# Altium schematic sheet Sheet2.SchDoc
size A4
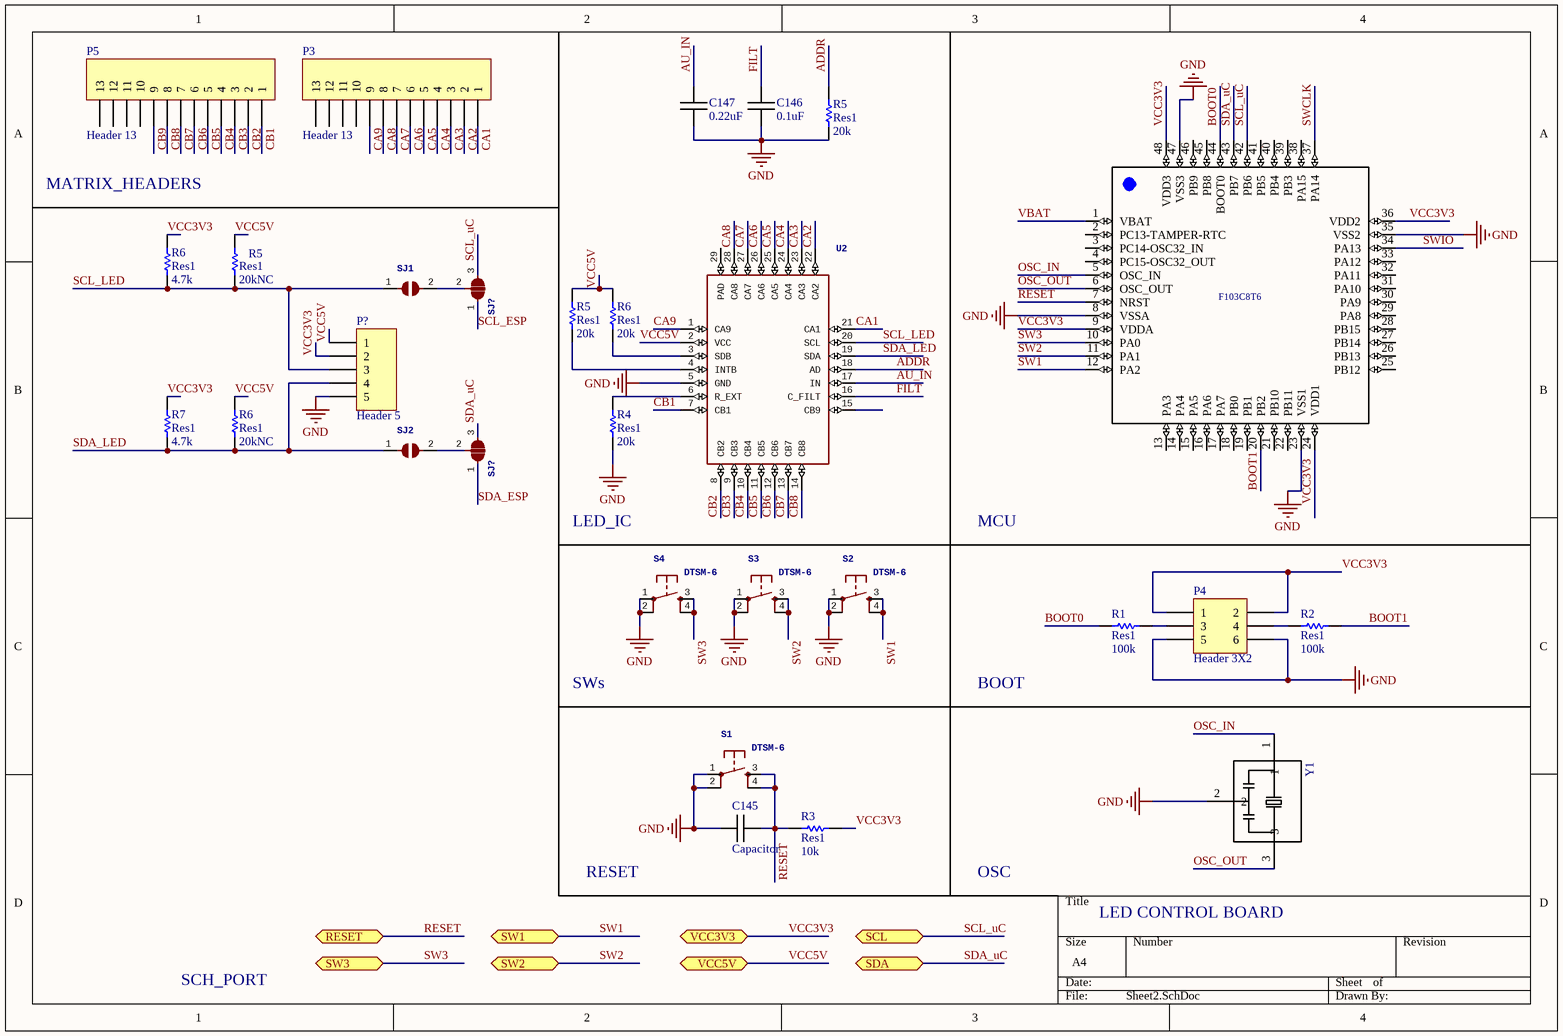
[diagram p0: Sheet2.SchDoc]

## Parts
(Parts that share a designator on the sheet are numbered #1, #2 ... from top to bottom, then left to right.)
C145  Capacitor  [C 0603 / 1608]
C146  0.1uF  [C 0603 / 1608]
C147  0.22uF  [C 0603 / 1608]
P3  Header 13  [HDR1X13]
P4  Header 3X2  [HDR2X3]
P5  Header 13  [HDR1X13]
P?  Header 5  [HDR1X5]
R1  Res1  value 100k  [C 0603 / 1608]
R2  Res1  value 100k  [C 0603 / 1608]
R3  Res1  value 10k  [C 0603 / 1608]
R4  Res1  value 20k  [C 0603 / 1608]
R5#1  Res1  value 20k  [C 0603 / 1608]
R5#2  Res1  value 20kNC  [C 0603 / 1608]
R5#3  Res1  value 20k  [C 0603 / 1608]
R6#1  Res1  value 4.7k  [C 0603 / 1608]
R6#2  Res1  value 20k  [C 0603 / 1608]
R6#3  Res1  value 20kNC  [C 0603 / 1608]
R7  Res1  value 4.7k  [C 0603 / 1608]
S1  DTSM-6  [DTSM-6]
S2  DTSM-6  [DTSM-6]
S3  DTSM-6  [DTSM-6]
S4  DTSM-6  [DTSM-6]
SJ1  (no value)  [SOLDERJUMPER_CLOSEDWIRE]
SJ2  (no value)  [SOLDERJUMPER_CLOSEDWIRE]
SJ?#1  (no value)  [SOLDERJUMPER_2WAY_OPEN_NOPASTE]
SJ?#2  (no value)  [SOLDERJUMPER_2WAY_OPEN_NOPASTE]
U1  STM32F103C8T6  [LQFP48_7X7MM_0.5MMPP]  (value not drawn)
U2  LED Lighting Drivers LED Driver   Source:  Datasheet  [QFN40P400X400X80-29N]  (value not drawn)
Y1  (no value)  [OSC_CSTCE8M00G55-R0]

## Ports
RESET (bidir), SCL (bidir), SDA (bidir), SW1 (bidir), SW2 (bidir), SW3 (bidir), VCC3V3 (bidir), VCC5V (bidir)

## Nets
GND: C145.2 C146.1 C147.1 P4.5 P4.6 P?.5 R4.2 R5#1.1 S1.1 S1.2 S2.1 S2.2 S3.1 S3.2 S4.1 S4.2 U1.8(VSSA) U1.23(VSS1) U1.35(VSS2) U1.47(VSS3) U2.5(GND) Y1.2
ADDR: R5#1.2 U2.18(AD)
AU_IN: C147.2 U2.17(IN)
BOOT0: R1.1 U1.44(BOOT0)
BOOT1: R2.2 U1.20(PB2)
CA1: P3.1 U2.21(CA1)
CA2: P3.2 U2.22(CA2)
CA3: P3.3 U2.23(CA3)
CA4: P3.4 U2.24(CA4)
CA5: P3.5 U2.25(CA5)
CA6: P3.6 U2.26(CA6)
CA7: P3.7 U2.27(CA7)
CA8: P3.8 U2.28(CA8)
CA9: P3.9 U2.1(CA9)
CB1: P5.1 U2.7(CB1)
CB2: P5.2 U2.8(CB2)
CB3: P5.3 U2.9(CB3)
CB4: P5.4 U2.10(CB4)
CB5: P5.5 U2.11(CB5)
CB6: P5.6 U2.12(CB6)
CB7: P5.7 U2.13(CB7)
CB8: P5.8 U2.14(CB8)
CB9: P5.9
FILT: C146.2 U2.16(C_FILT)
OSC_IN: U1.5(OSC_IN) Y1.1
OSC_OUT: U1.6(OSC_OUT) Y1.3
RESET: C145.1 R3.2 S1.3 S1.4 U1.7(NRST) ; port RESET
SCL_ESP: SJ?#1.1
SCL_LED: P?.3 R5#2.2 R6#1.2 SJ1.1 U2.20(SCL)
SCL_uC: SJ?#1.3 U1.42(PB6) ; port SCL
SDA_ESP: SJ?#2.1
SDA_LED: P?.4 R6#3.2 R7.2 SJ2.1 U2.19(SDA)
SDA_uC: SJ?#2.3 U1.43(PB7) ; port SDA
SW1: S2.3 S2.4 U1.12(PA2) ; port SW1
SW2: S3.3 S3.4 U1.11(PA1) ; port SW2
SW3: S4.3 S4.4 U1.10(PA0) ; port SW3
SWCLK: U1.37(PA14)
SWIO: U1.34(PA13)
VBAT: U1.1(VBAT)
VCC3V3: P4.1 P4.2 P?.2 R3.1 R6#1.1 R7.1 U1.9(VDDA) U1.24(VDD1) U1.36(VDD2) U1.48(VDD3) ; port VCC3V3
VCC5V: P?.1 R5#2.1 R5#3.1 R6#2.1 R6#3.1 U2.2(VCC) ; port VCC5V
NetP4_3: P4.3 R1.2
NetP4_4: P4.4 R2.1
NetR4_1: R4.1 U2.6(R_EXT)
NetR5#3_2: R5#3.2 U2.4(INTB)
NetR6#2_2: R6#2.2 U2.3(SDB)
NetSJ1_2: SJ1.2 SJ?#1.2
NetSJ2_2: SJ2.2 SJ?#2.2

Not connected (* = marked no-connect by the designer): P3 10 11 12 13; P5 10 11 12 13; U1 2(PC13-TAMPER-RTC) 3(PC14-OSC32_IN) 4(PC15-OSC32_OUT) 13(PA3) 14(PA4) 15(PA5) 16(PA6) 17(PA7) 18(PB0) 19(PB1) 21(PB10) 22(PB11) 25(PB12) 26(PB13) 27(PB14) 28(PB15) 29(PA8) 30(PA9) 31(PA10) 32(PA11) 33(PA12) 38(PA15) 39(PB3) 40(PB4) 41(PB5) 45(PB8) 46(PB9); U2 15(CB9) 29(PAD)

## Notes on the sheet
- MATRIX_HEADERS
- LED_IC
- MCU
- SWs
- BOOT
- RESET
- OSC
- LED CONTROL BOARD
- SCH_PORT
- (in symbol STM32F103C8T6) F103C8T6

## Library data of the parts
C146 C147 = Capacitor
P3 P5 = Header 13: Header, 13-Pin; LatestRevisionDate: 17-Jul-2002; LatestRevisionNote: Re-released for DXP Platform.; Publisher: Altium Limited
P4 = Header 3X2: Header, 3-Pin, Dual row; LatestRevisionDate: 17-Jul-2002; LatestRevisionNote: Re-released for DXP Platform.; Publisher: Altium Limited
P? = Header 5: Header, 5-Pin; LatestRevisionDate: 17-Jul-2002; LatestRevisionNote: Re-released for DXP Platform.; Publisher: Altium Limited
R1-R4 R5#1-R5#3 R6#1-R6#3 R7 = Res1: Resistor; Published: 8-Jun-2000; LatestRevisionDate: 17-Jul-2002; LatestRevisionNote: Re-released for DXP Platform.; PackageReference: AXIAL-0.3; Publisher: Altium Limited; PackageDescription: Axial Device, Thru-Hole; 2 Leads; 0.3 in Pin Spacing
SJ1 SJ2 = SOLDERJUMPERCLOSED
SJ?#1 SJ?#2 = SOLDERJUMPER_2WAY
U1 = STM32F103C8T6: Mainstream Performance line, ARM Cortex-M3 MCU with 64 Kbytes Flash, 72 MHz CPU, motor control, USB and CAN; MF: STMicroelectronics; Price: 4.41 USD; Package: LQFP-48 STMicroelectronics; Availability: Good; MP: STM32F103C8T6; Value: *
U2 = IS31FL3731-QFLS2-TR: Manufacturer_Name: Integrated Silicon Solution Inc.; Manufacturer_Part_Number: IS31FL3731-QFLS2-TR; Arrow_Part_Number: IS31FL3731-QFLS2-TR; Arrow_Price-Stock: https://www.arrow.com/en/products/is31fl3731-qfls2-tr/integrated-silicon-solution-inc; Height: 0.8mm
Y1 = CSTCE8M00G55-R0: Ceramic Resonator 8MHz ??0.5% _Tol_ ??0.2% _Stability_ 33pF 40Ohm 3-Pin CSMD T/R; MF: Murata; SnapEDA_Link: https://www.snapeda.com/parts/CSTCE8M00G55-R0/Murata%20Electronics%20North%20America/view-part/?ref=snap; Availability: Good; MP: CSTCE8M00G55-R0; Price: 0.27 USD; Package: SMD-3 Murata; Value: *